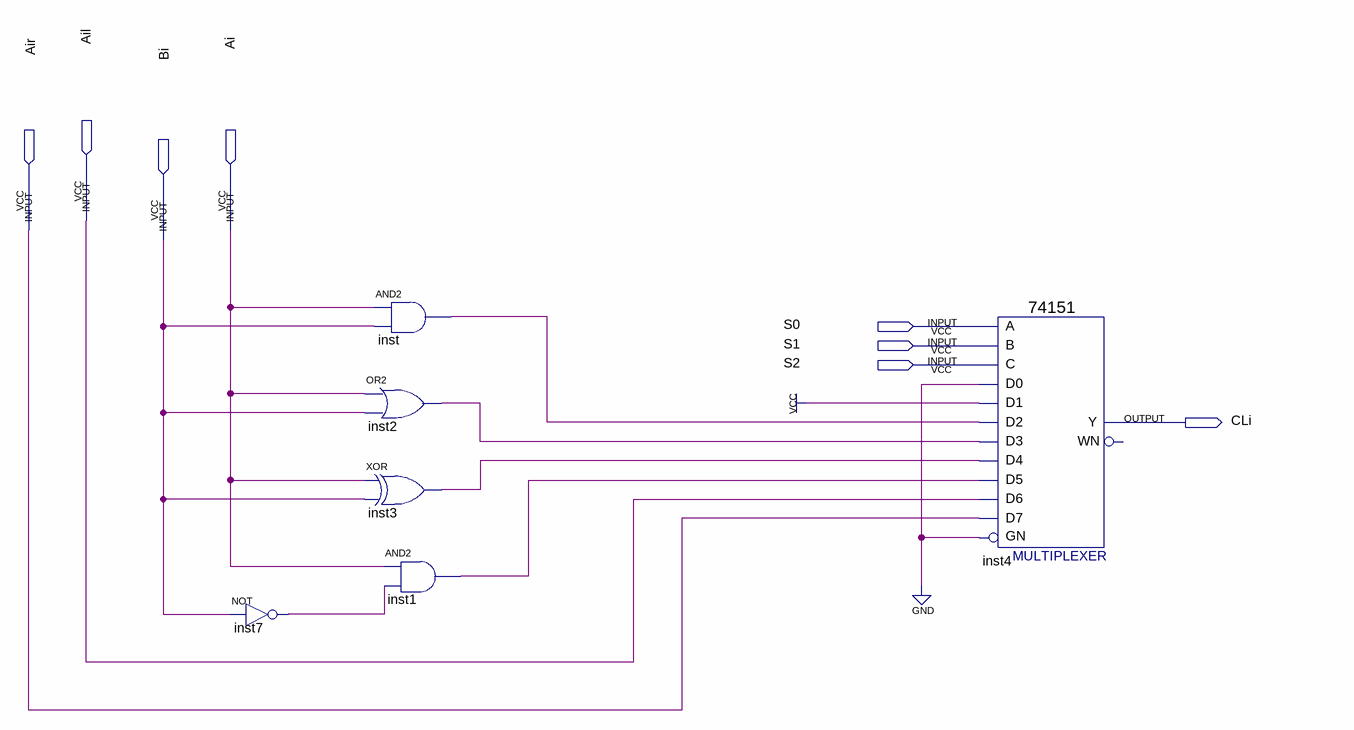
[diagram p0: schematic sheet]
// Quartus schematic logiccircuit1bit2.bdf as structural Verilog: 6 symbols, 8 pins
module logiccircuit1bit2 (
  input  Ail,
  input  Air,
  input  Ai,
  input  Bi,
  input  S0,
  input  S1,
  input  S2,
  output CLi
);

  wire inst1_out, inst2_out, inst3_out, inst7_out, inst_out;

  not inst7 (inst7_out, Bi);
  and inst (inst_out, Ai, Bi);
  or inst2 (inst2_out, Ai, Bi);
  xor inst3 (inst3_out, Ai, Bi);
  and inst1 (inst1_out, Ai, inst7_out);
  \74151  inst4 (
    .GN(1'b0), .C(S2), .B(S1), .A(S0), .D5(inst1_out), .D0(1'b0), .D1(1'b1), .D4(inst3_out), .D3(inst2_out),
    .D2(inst_out), .D6(Ail), .D7(Air), .Y(CLi));  // open: WN
endmodule
